# EAGLE design Headphone_Amp (EAGLE 9.5.0)
CNAME: Blueskylark Electronics; CREVISION: 1.0
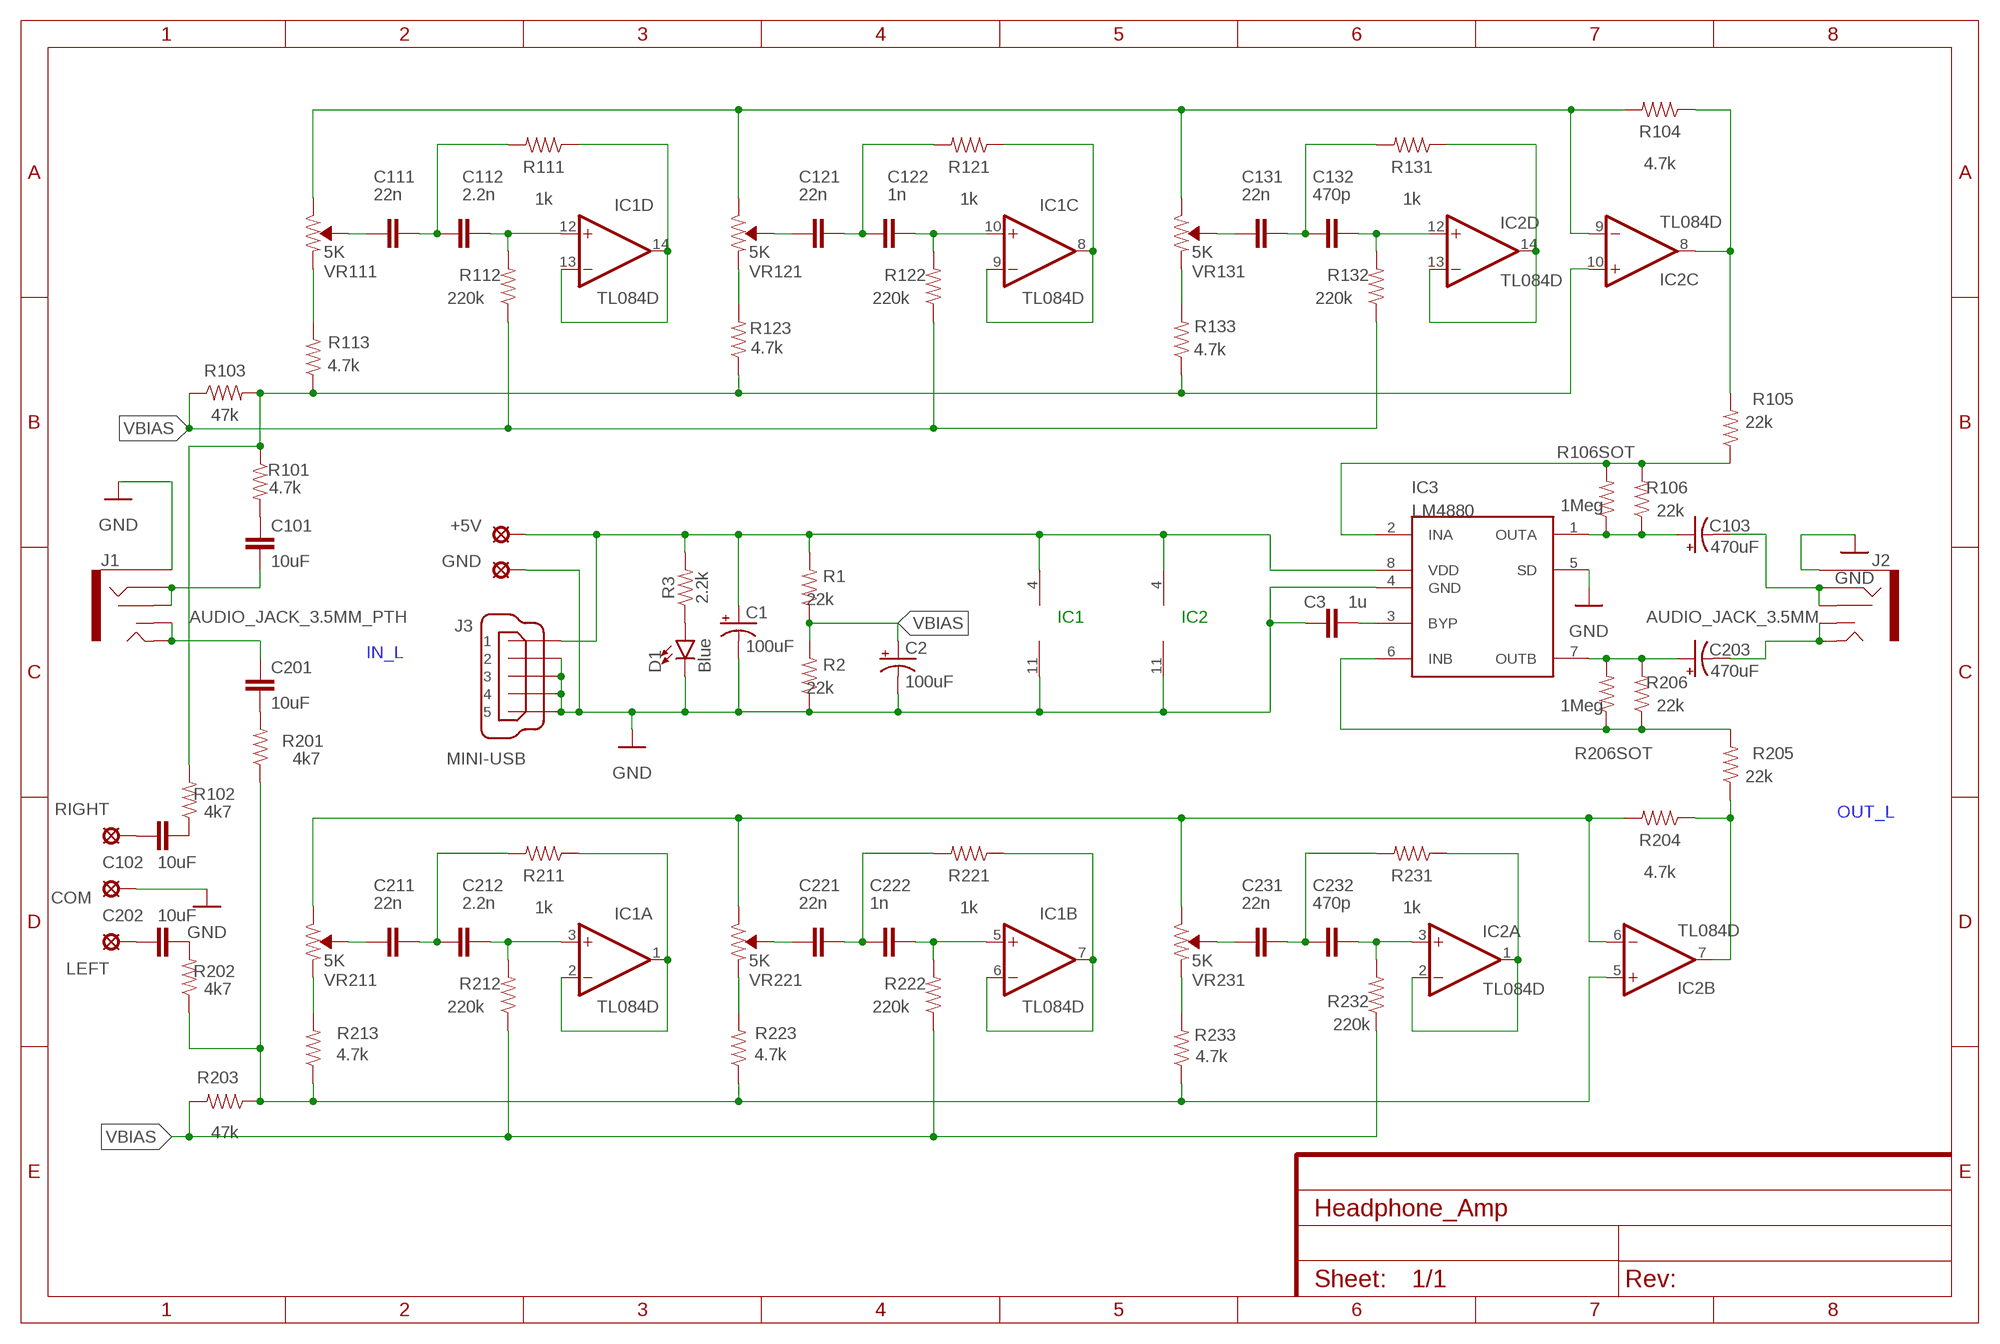
[diagram p0: schematic, sheet 1]

## Parts
+5V  SE14  [SE14]
C1  100uF  100UF-POLAR-EIA7343-16V-10%(TANT)  [EIA7343]
C2  100uF  100UF-POLAR-EIA7343-16V-10%(TANT)  [EIA7343]
C3  1u  0.1UF-0603-25V-5%  [0603]
C101  10uF  10UF-0805-10V-10%  [0805]
C102  10uF  10UF-0805-10V-10%  [0805]
C103  470uF  100UF-POLAR-EIA7343-16V-10%(TANT)  [EIA7343]
C111  22n  0.1UF-0603-25V-5%  [0603]
C112  2.2n  0.1UF-0603-25V-5%  [0603]
C121  22n  0.1UF-0603-25V-5%  [0603]
C122  1n  0.1UF-0603-25V-5%  [0603]
C131  22n  0.1UF-0603-25V-5%  [0603]
C132  470p  0.1UF-0603-25V-5%  [0603]
C201  10uF  10UF-0805-10V-10%  [0805]
C202  10uF  10UF-0805-10V-10%  [0805]
C203  470uF  100UF-POLAR-EIA7343-16V-10%(TANT)  [EIA7343]
C211  22n  0.1UF-0603-25V-5%  [0603]
C212  2.2n  0.1UF-0603-25V-5%  [0603]
C221  22n  0.1UF-0603-25V-5%  [0603]
C222  1n  0.1UF-0603-25V-5%  [0603]
C231  22n  0.1UF-0603-25V-5%  [0603]
C232  470p  0.1UF-0603-25V-5%  [0603]
COM  SE14  [SE14]
D1  Blue  LED3MM  [LED_3MM]
GND  SE14  [SE14]
IC1  TL084D  [SO14]
IC2  TL084D  [SO14]
IC3  LM4880  [SO08]
J1  AUDIO_JACK_3.5MM_PTH  [AUDIO-JACK]
J2  AUDIO_JACK_3.5MM  AUDIO_JACK_3.5MM_PTH  [AUDIO-JACK]
J3  MINI-USB  MINI-USB-UX60A-MB-5ST  [UX60A-MB-5ST]
LEFT  SE14  [SE14]
R1  22k  RESISTOR0603  [0603]
R2  22k  RESISTOR0603  [0603]
R3  2.2k  2.2KOHM-0603-1/10W-1%  [0603]
R101  4.7k  RESISTOR0603  [0603]
R102  4k7  RESISTOR0603  [0603]
R103  47k  RESISTOR0603  [0603]
R104  4.7k  RESISTOR0603  [0603]
R105  22k  RESISTOR0603  [0603]
R106  22k  RESISTOR0603  [0603]
R106SOT  1Meg  RESISTORAXIAL-0.3  [AXIAL-0.3]
R111  1k  RESISTOR0603  [0603]
R112  220k  RESISTOR0603  [0603]
R113  4.7k  4.7KOHM-0603-1/10W-1%  [0603]
R121  1k  RESISTOR0603  [0603]
R122  220k  RESISTOR0603  [0603]
R123  4.7k  4.7KOHM-0603-1/10W-1%  [0603]
R131  1k  RESISTOR0603  [0603]
R132  220k  RESISTOR0603  [0603]
R133  4.7k  4.7KOHM-0603-1/10W-1%  [0603]
R201  4k7  RESISTOR0603  [0603]
R202  4k7  RESISTOR0603  [0603]
R203  47k  RESISTOR0603  [0603]
R204  4.7k  RESISTOR0603  [0603]
R205  22k  RESISTOR0603  [0603]
R206  22k  RESISTOR0603  [0603]
R206SOT  1Meg  RESISTORAXIAL-0.3  [AXIAL-0.3]
R211  1k  RESISTOR0603  [0603]
R212  220k  RESISTOR0603  [0603]
R213  4.7k  4.7KOHM-0603-1/10W-1%  [0603]
R221  1k  RESISTOR0603  [0603]
R222  220k  RESISTOR0603  [0603]
R223  4.7k  4.7KOHM-0603-1/10W-1%  [0603]
R231  1k  RESISTOR0603  [0603]
R232  220k  RESISTOR0603  [0603]
R233  4.7k  4.7KOHM-0603-1/10W-1%  [0603]
RIGHT  SE14  [SE14]
VR111  5K  TRIMPOTTRIMPOT-PTH-3362P  [TRIMPOT-PTH-3362P]
VR121  5K  TRIMPOTTRIMPOT-PTH-3362P  [TRIMPOT-PTH-3362P]
VR131  5K  TRIMPOTTRIMPOT-PTH-3362P  [TRIMPOT-PTH-3362P]
VR211  5K  TRIMPOTTRIMPOT-PTH-3362P  [TRIMPOT-PTH-3362P]
VR221  5K  TRIMPOTTRIMPOT-PTH-3362P  [TRIMPOT-PTH-3362P]
VR231  5K  TRIMPOTTRIMPOT-PTH-3362P  [TRIMPOT-PTH-3362P]

## Nets
GND: C1.C(-) C2.C(-) C3.1 COM.MP D1.K(C) GND.MP IC1.11(P:V-) IC2.11(P:V-) IC3.4(GND) IC3.5(SD) J1.SLEEVE J2.SLEEVE J3.2 J3.3 J3.4 J3.5 R2.1
HDPHNE: C103.C(-) J2.RING J2.RSH
IN_L: C201.1 J1.TIP J1.TSH
N$1: C101.2 J1.RING J1.RSH
N$2: D1.A R3.1
N$3: C3.2 IC3.3(BYP)
N$4: C111.2 C112.1 R111.2
N$5: C112.2 IC1.12(D:+IN) R112.2
N$6: IC1.1(A:OUT) IC1.2(A:-IN) R211.1
N$7: C111.1 VR111.2(WIPER)
N$8: C203.C(-) J2.TIP J2.TSH
N$9: C121.2 C122.1 R121.2
N$10: C122.2 IC1.10(C:+IN) R122.2
N$11: C201.2 R201.2
N$12: R113.2 VR111.1(CCW)
N$13: C131.2 C132.1 R131.2
N$14: C132.2 IC2.12(D:+IN) R132.2
N$15: C121.1 VR121.2(WIPER)
N$16: IC3.2(INA) R105.1 R106.2 R106SOT.P$2
N$17: C103.A(+) IC3.1(OUTA) R106.1 R106SOT.P$1
N$18: IC3.6(INB) R205.2 R206.1 R206SOT.P$1
N$19: C203.A(+) IC3.7(OUTB) R206.2 R206SOT.P$2
N$20: R123.2 VR121.1(CCW)
N$21: C211.2 C212.1 R211.2
N$22: C212.2 IC1.3(A:+IN) R212.2
N$23: R213.2 VR211.1(CCW)
N$24: IC1.6(B:-IN) IC1.7(B:OUT) R221.1
N$25: IC2.1(A:OUT) IC2.2(A:-IN) R231.1
N$26: IC2.9(C:-IN) R104.2 VR111.3(CW) VR121.3(CW) VR131.3(CW)
N$27: C221.2 C222.1 R221.2
N$28: C222.2 IC1.5(B:+IN) R222.2
N$29: C211.1 VR211.2(WIPER)
N$30: IC2.6(B:-IN) R204.2 VR211.3(CW) VR221.3(CW) VR231.3(CW)
N$31: C231.2 C232.1 R231.2
N$32: C232.2 IC2.3(A:+IN) R232.2
N$33: R223.2 VR221.1(CCW)
N$34: IC1.8(C:OUT) IC1.9(C:-IN) R121.1
N$35: R133.2 VR131.1(CCW)
N$36: IC2.10(C:+IN) R101.1 R102.2 R103.2 R113.1 R123.1 R133.1
N$37: +5V.MP C1.A(+) IC1.4(P:V+) IC2.4(P:V+) IC3.8(VDD) J3.1 R1.2 R3.2
N$38: C101.1 R101.2
N$42: IC1.13(D:-IN) IC1.14(D:OUT) R111.1
N$43: C131.1 VR131.2(WIPER)
N$44: IC2.13(D:-IN) IC2.14(D:OUT) R131.1
N$46: C221.1 VR221.2(WIPER)
N$47: C231.1 VR231.2(WIPER)
N$48: R233.2 VR231.1(CCW)
N$52: C102.1 RIGHT.MP
N$53: C202.1 LEFT.MP
N$54: C202.2 R202.2
N$55: C102.2 R102.1
N$56: IC2.5(B:+IN) R201.1 R202.1 R203.1 R213.1 R223.1 R233.1
OUT-R: IC2.8(C:OUT) R104.1 R105.2
OUT_L: IC2.7(B:OUT) R204.1 R205.1
VBIAS: C2.A(+) R1.1 R2.2 R103.1 R112.1 R122.1 R132.1 R203.2 R212.1 R222.1 R232.1

## Notes on the sheet
- IC1 | IC2

## Library data of the parts
+5V = solpad:SE14: SOLDER PAD E1553, drill 1,4mm, distributor Buerklin, 07F820; SPICEMODEL: PwrPlus; SPICEPREFIX: X
C1 C2 = SparkFun-Capacitors:100UF-POLAR: 100µF polarized capacitors A capacitor is a passive two-terminal electrical component used to store electrical energy temporarily in an electric field.; PROD_ID: CAP-08702; SPICEPREFIX: C
C3 C111 C112 C121 C122 C131 C132 C211 C212 C221 C222 C231 C232 = SparkFun-Capacitors:0.1UF: 0.1µF ceramic capacitors A capacitor is a passive two-terminal electrical component used to store electrical energy temporarily in an electric field.; PROD_ID: CAP-08604; SPICEPREFIX: C; VALUE: 0.1uF
C101 C102 C201 C202 = SparkFun-Capacitors:10UF: 10.0µF ceramic capacitors A capacitor is a passive two-terminal electrical component used to store electrical energy temporarily in an electric field.; PROD_ID: CAP-11330; SPICEPREFIX: C
C103 C203 = SparkFun-Capacitors:100UF-POLAR: 100µF polarized capacitors A capacitor is a passive two-terminal electrical component used to store electrical energy temporarily in an electric field.; PROD_ID: CAP-08702; SPICEPREFIX: C; VALUE: 100uF
COM GND = solpad:SE14: SOLDER PAD E1553, drill 1,4mm, distributor Buerklin, 07F820; SPICEMODEL: PwrMinus; SPICEPREFIX: X
D1 = SparkFun-LED:LED: LED (Generic) Standard schematic elements and footprints for 5mm, 3mm, 1206, and 0603 sized LEDs. Generic LEDs with no color specified.; PROD_ID: DIO-08794; SPICEMODEL: DMOD; SPICEPREFIX: D
IC1 IC2 = linear:TL084: OP AMP; SPICEMODEL: TL084x4; SPICEPREFIX: X
IC3 = LM4880:LM4880; AVAILABILITY: Unavailable; MF: Texas Instruments; MP: LM4880; PACKAGE: None; PRICE: None; SPICEMODEL: Fake_LM4880; SPICEPREFIX: X
J1 = SparkFun-Connectors:AUDIO_JACK_3.5MM: Audio Jack 3.5mm variants of PTH and SMT stereo audio jack with bypass switches. SparkFun Products: SparkFun SparkPunk Sound Kit <[https://www.sparkfun.com/products/11177]> - PTH MP3 Trigger <https://www.sparkfun.com/products/13720> -3.5mm SMD SparkFun PicoBoard <https://www.sparkfun.com/products/11888>- 2.5mm SMD; PROD_ID: CONN-08774; SF_ID: PRT-08032; SPICEMODEL: StereoIn; SPICEPREFIX: X
J2 = SparkFun-Connectors:AUDIO_JACK_3.5MM: Audio Jack 3.5mm variants of PTH and SMT stereo audio jack with bypass switches. SparkFun Products: SparkFun SparkPunk Sound Kit <[https://www.sparkfun.com/products/11177]> - PTH MP3 Trigger <https://www.sparkfun.com/products/13720> -3.5mm SMD SparkFun PicoBoard <https://www.sparkfun.com/products/11888>- 2.5mm SMD; PROD_ID: CONN-08774; SF_ID: PRT-08032; SPICEMODEL: StereoOut; SPICEPREFIX: X
J3 = con-hirose:MINI-USB-: MINI USB Connector Source: http://www.hirose.co.jp/cataloge_hp/e24000019.pdf; OC_FARNELL: unknown; OC_NEWARK: unknown; SPICEMODEL: USBSupply; SPICEPREFIX: X
LEFT RIGHT = solpad:SE14: SOLDER PAD E1553, drill 1,4mm, distributor Buerklin, 07F820; SPICEMODEL: AudioIn; SPICEPREFIX: X
R1 R2 R101-R106 R106SOT R111 R112 R121 R122 R131 R132 R201-R206 R206SOT R211 R212 R221 R222 R231 R232 = SparkFun-Resistors:RESISTOR: Generic Resistor Package; SPICEPREFIX: R
R3 = SparkFun-Resistors:2.2KOHM: 2.2kΩ resistor A resistor is a passive two-terminal electrical component that implements electrical resistance as a circuit element. Resistors act to reduce current flow, and, at the same time, act to lower voltage levels within circuits. - Wikipedia; PROD_ID: RES-08272; SPICEPREFIX: R
R113 R123 R133 R213 R223 R233 = SparkFun-Resistors:4.7KOHM: 4.7kΩ resistor A resistor is a passive two-terminal electrical component that implements electrical resistance as a circuit element. Resistors act to reduce current flow, and, at the same time, act to lower voltage levels within circuits. - Wikipedia; PROD_ID: RES-07857; SPICEPREFIX: R
VR111 VR211 = SparkFun-Resistors:TRIMPOT: Trimming Potentiometer (Trimpot) Philip wos 'ere Three-terminal potentiometers, with an adjustable wiper and two adjustable resistors. A pot can be used to create a configurable voltage divider, or as a variable resistor. "Trimpots" are a subset of potentiometers, usually intended for "set-and-forget" applications. They're often more delicate than standard potentiometers - rated for fewer turns. Variants PTH-KNOB - PTH Trimpot w/ finger-adjustable knob Trimpot 10K with Knob <https://www.sparkfun.com/products/9806> (COM-09806) Datasheet <http://www.sparkfun.com/datasheets/Components/General/TSR-3386.pdf> SMD-3MM-CLOSED-FRAME - SMD 3mm Square Closed-Frame Trimpot Used on e.g. EasyDriver - Stepper Motor Driver <https://www.sparkfun.com/products/12779> Datasheet <http://www.bitechnologies.com/pdfs/22.pdf> (22AR10KTR) SMD-5MM - SMD 5mm Square Closed-Frame Trimpot Used on e.g. IOIO-OTG - V2.2 <https://www.sparkfun.com/products/13613> Datasheet <http://www.vishay.com/docs/51008/ts53.pdf> (TS53YL502MR10) SMD-3MM-1/10W-25% - 3mm Square Open-Frame Trimpot Used on e.g. SparkFun Shapeoko <https://www.sparkfun.com/products/13899> Datasheet <http://www.bourns.com/docs/Product-Datasheets/TC33.pdf> (TC33X-2-103E); SPICEMODEL: POT_VR111; SPICEPREFIX: X
VR121 VR221 = SparkFun-Resistors:TRIMPOT: Trimming Potentiometer (Trimpot) Philip wos 'ere Three-terminal potentiometers, with an adjustable wiper and two adjustable resistors. A pot can be used to create a configurable voltage divider, or as a variable resistor. "Trimpots" are a subset of potentiometers, usually intended for "set-and-forget" applications. They're often more delicate than standard potentiometers - rated for fewer turns. Variants PTH-KNOB - PTH Trimpot w/ finger-adjustable knob Trimpot 10K with Knob <https://www.sparkfun.com/products/9806> (COM-09806) Datasheet <http://www.sparkfun.com/datasheets/Components/General/TSR-3386.pdf> SMD-3MM-CLOSED-FRAME - SMD 3mm Square Closed-Frame Trimpot Used on e.g. EasyDriver - Stepper Motor Driver <https://www.sparkfun.com/products/12779> Datasheet <http://www.bitechnologies.com/pdfs/22.pdf> (22AR10KTR) SMD-5MM - SMD 5mm Square Closed-Frame Trimpot Used on e.g. IOIO-OTG - V2.2 <https://www.sparkfun.com/products/13613> Datasheet <http://www.vishay.com/docs/51008/ts53.pdf> (TS53YL502MR10) SMD-3MM-1/10W-25% - 3mm Square Open-Frame Trimpot Used on e.g. SparkFun Shapeoko <https://www.sparkfun.com/products/13899> Datasheet <http://www.bourns.com/docs/Product-Datasheets/TC33.pdf> (TC33X-2-103E); SPICEMODEL: POT_VR121; SPICEPREFIX: X
VR131 VR231 = SparkFun-Resistors:TRIMPOT: Trimming Potentiometer (Trimpot) Philip wos 'ere Three-terminal potentiometers, with an adjustable wiper and two adjustable resistors. A pot can be used to create a configurable voltage divider, or as a variable resistor. "Trimpots" are a subset of potentiometers, usually intended for "set-and-forget" applications. They're often more delicate than standard potentiometers - rated for fewer turns. Variants PTH-KNOB - PTH Trimpot w/ finger-adjustable knob Trimpot 10K with Knob <https://www.sparkfun.com/products/9806> (COM-09806) Datasheet <http://www.sparkfun.com/datasheets/Components/General/TSR-3386.pdf> SMD-3MM-CLOSED-FRAME - SMD 3mm Square Closed-Frame Trimpot Used on e.g. EasyDriver - Stepper Motor Driver <https://www.sparkfun.com/products/12779> Datasheet <http://www.bitechnologies.com/pdfs/22.pdf> (22AR10KTR) SMD-5MM - SMD 5mm Square Closed-Frame Trimpot Used on e.g. IOIO-OTG - V2.2 <https://www.sparkfun.com/products/13613> Datasheet <http://www.vishay.com/docs/51008/ts53.pdf> (TS53YL502MR10) SMD-3MM-1/10W-25% - 3mm Square Open-Frame Trimpot Used on e.g. SparkFun Shapeoko <https://www.sparkfun.com/products/13899> Datasheet <http://www.bourns.com/docs/Product-Datasheets/TC33.pdf> (TC33X-2-103E); SPICEMODEL: POT_VR131; SPICEPREFIX: X

## Board
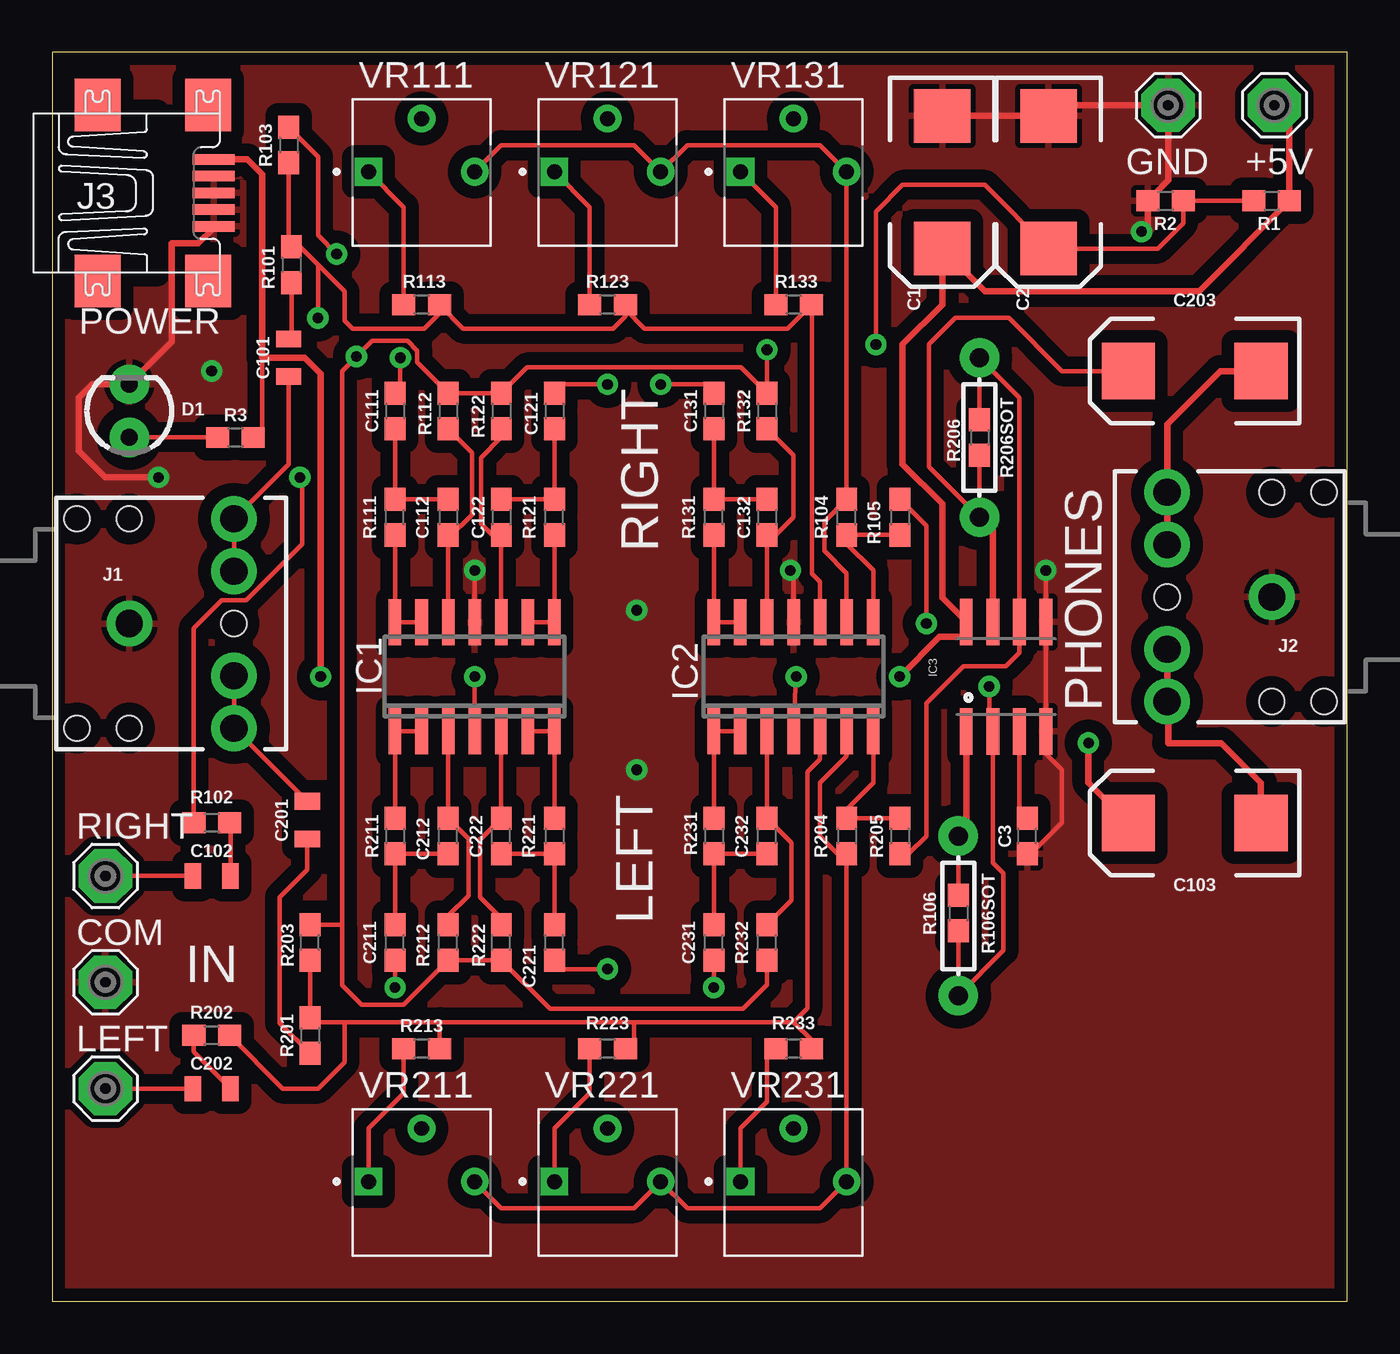
[diagram p1: board, top side]
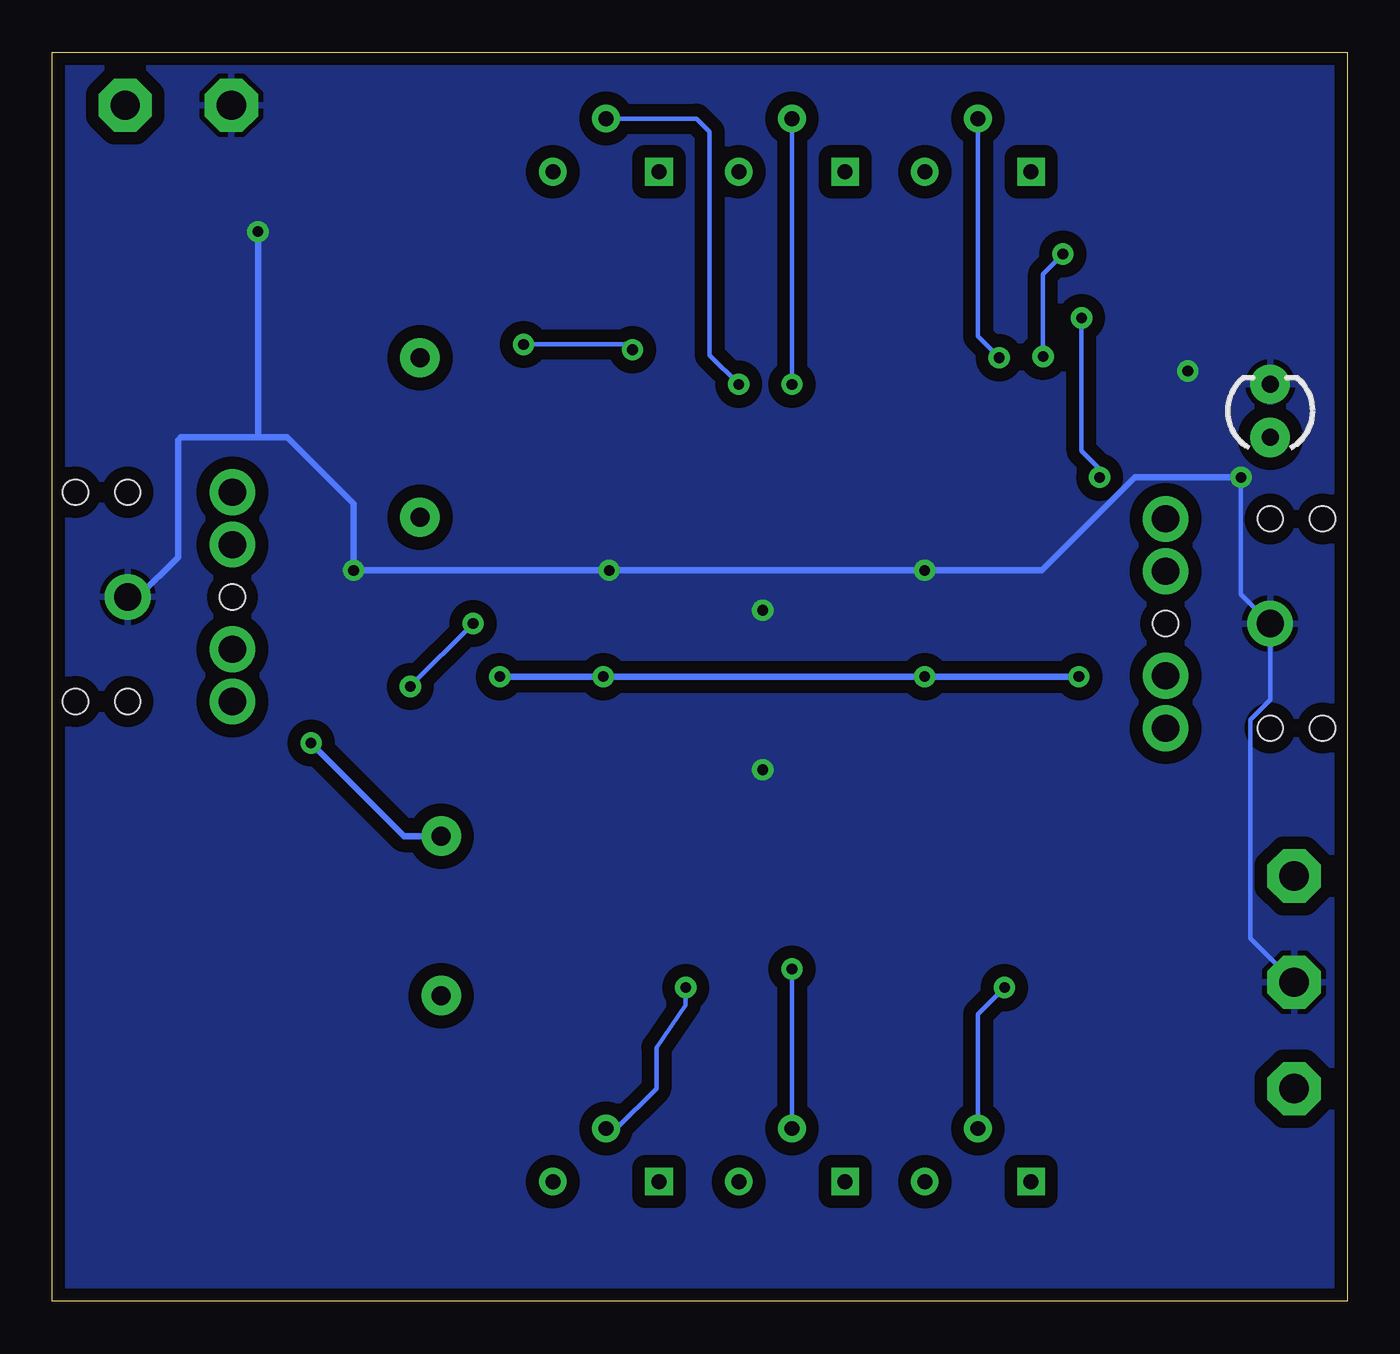
[diagram p2: board, bottom side, seen from below]

Size 61.9 x 59.68 mm. Coordinates in mm from the lower left corner, seen from the top.
Outline: 0,0 61.9,0 61.9,59.68 0,59.68 0,0
Copper layers (1*16): Top 0.035mm / dielectric 1.5mm / Bottom 0.035mm
Design rules "SparkFun": minimum track width 8mil, minimum drill 20mil, track to track 8mil, track to pad 8mil, pad to pad 8mil, via to via 8mil, smd to smd 8mil, copper to edge 10mil, drill to drill 8mil, minimum pad ring 12mil, minimum via ring 10mil, stop-mask expansion 4mil, vias tented up to drill 25mil, thermal gap 10mil

### Footprints (pad centres in the part's own frame; a part is rotated, then mirrored left to right if it is on the bottom)
SE14 = drill 1.397 pad 2.54 octagon: MP 0,0
EIA7343 = smd 2.55 x 2.7: A 3.17,0; C -3.17,0
0603 = smd 1.1 x 1: 1 -0.85,0; 2 0.85,0
0805 = smd 0.8 x 1.2: 1 -0.9,0; 2 0.9,0
LED_3MM = drill 0.813 pad 1.88: A -1.27,0; K 1.27,0
SO14 = smd 0.6 x 2.2: 1 -3.81,-2.6; 2 -2.54,-2.6; 3 -1.27,-2.6; 4 0,-2.6; 5 1.27,-2.6; 6 2.54,-2.6; 7 3.81,-2.6; 8 3.81,2.6; 9 2.54,2.6; 10 1.27,2.6; 11 0,2.6; 12 -1.27,2.6; 13 -2.54,2.6; 14 -3.81,2.6
SO08 = smd 0.61 x 2.21: 1 -1.905,-2.616; 2 -0.635,-2.616; 3 0.635,-2.616; 4 1.905,-2.616; 5 1.905,2.616; 6 0.635,2.616; 7 -0.635,2.616; 8 -1.905,2.616
AUDIO-JACK = drill 1.3 pad 2.184: RING 5,5; RSH 5,2.5; SLEEVE 0,0; TIP 5,-5; TSH 5,-2.5 | hole 1.2: 0,5; -2.5,5; -2.5,-5; 0,-5; 5,0
UX60A-MB-5ST = smd 2 x 0.5: 1 2.25,1.6; 2 2.25,0.8; 3 2.25,0; 4 2.25,-0.8; 5 2.25,-1.6 | smd 2.2 x 2.5: M1 -3.3,-4.2; M2 -3.3,4.2; M3 2,4.2; M4 2,-4.2
AXIAL-0.3 = drill 0.9 pad 1.88: P$1 -3.81,0; P$2 3.81,0
TRIMPOT-PTH-3362P = drill 0.714 square: 1 -2.54,0 | drill 0.714: 2 0,2.54; 3 2.54,0

### Placement (x,y rotation side)
+5V  58.42,57.15 0 top
C1  42.55,53.47 270 top
C2  47.62,53.47 270 top
C3  46.61,22.23 90 top
C101  11.3,45.09 270 top
C102  7.62,20.32 0 top
C103  54.61,22.86 180 top
C111  16.38,42.55 270 top
C112  18.92,37.47 270 top
C121  24,42.55 270 top
C122  21.46,37.47 270 top
C131  31.62,42.55 270 top
C132  34.16,37.47 270 top
C201  12.19,22.99 270 top
C202  7.62,10.16 0 top
C203  54.61,44.45 180 top
C211  16.38,17.14 90 top
C212  18.92,22.23 90 top
C221  24,17.14 90 top
C222  21.46,22.23 90 top
C231  31.62,17.14 90 top
C232  34.16,22.23 90 top
COM  2.54,15.24 0 top
D1  3.68,42.55 90 top
GND  53.34,57.15 0 top
IC1  20.19,29.84 0 top
IC2  35.43,29.84 0 top
IC3  45.59,29.84 0 top
J1  3.68,32.38 0 top
J2  58.29,33.66 180 top
J3  5.46,52.96 0 top
LEFT  2.54,10.16 0 top
R1  58.29,52.58 0 top
R2  53.21,52.58 0 top
R3  8.76,41.27 0 top
R101  11.43,49.53 270 top
R102  7.62,22.86 180 top
R103  11.3,55.24 270 top
R104  37.97,37.47 90 top
R105  40.51,37.47 270 top
R106  43.31,18.54 270 top
R106SOT  43.31,18.41 270 top
R111  16.38,37.47 90 top
R112  18.92,42.55 270 top
R113  17.65,47.62 180 top
R121  24,37.47 90 top
R122  21.46,42.55 270 top
R123  26.54,47.62 180 top
R131  31.62,37.47 90 top
R132  34.16,42.55 270 top
R133  35.43,47.62 180 top
R201  12.32,12.7 270 top
R202  7.62,12.7 180 top
R203  12.32,17.14 90 top
R204  37.97,22.23 270 top
R205  40.51,22.23 270 top
R206  44.32,41.27 270 top
R206SOT  44.32,41.27 270 top
R211  16.38,22.23 270 top
R212  18.92,17.14 90 top
R213  17.65,12.06 180 top
R221  24,22.23 270 top
R222  21.46,17.14 90 top
R223  26.54,12.06 180 top
R231  31.62,22.23 270 top
R232  34.16,17.14 90 top
R233  35.43,12.06 180 top
RIGHT  2.54,20.32 0 top
VR111  17.65,53.98 0 top
VR121  26.54,53.98 0 top
VR131  35.43,53.98 0 top
VR211  17.65,5.71 0 top
VR221  26.54,5.71 0 top
VR231  35.43,5.71 0 top

### Tracks (layer width: path | path; a pad name or v marks a point on that pad's centre or on a via)
GND  (via drill 0.51)
  Top 0.203: IC1.11 v20.19,34.92 | v35.28,34.92 35.43,34.77 IC2.11 | v47.5,34.92 IC3.5 IC3.4 47.5,26.16 48.26,25.4 48.26,22.86 46.77,21.38 C3.1 | 7.71,51.27 J3.5 | C2.C 48.14,57.15
  Top 0.305: C2.C C1.C | v5.08,39.37 2.54,39.37 1.27,40.64 1.27,43.18 1.91,43.81 D1.K 5.71,45.85 5.71,50.55 6.99,50.55 7.71,51.27 | 48.14,57.15 GND.MP 53.34,53.55 R2.1 52.36,51.4 v52.07,51.11
  Bottom 0.203: 55.75,41.27 55.88,41.15 | 57.78,33.66 J2.SLEEVE | v5.08,39.37 5.08,33.78 J1.SLEEVE 3.68,28.74 4.64,27.78 4.64,17.34 COM.MP
  Bottom 0.305: 52.07,41.27 50.67,41.27 47.5,38.1 v47.5,34.92 v35.28,34.92 v20.19,34.92 14.61,34.92 10.16,39.37 v5.08,39.37 | 52.07,41.27 55.75,41.27 | 55.88,41.15 55.88,35.56 57.78,33.66 | v52.07,51.11 52.07,41.27
  other vias: 27.94,33.02 27.94,25.4 7.62,44.45
  pour Top (isolate 0.61): 0,0 0,59.69 61.98,59.69 61.98,0
  pour Bottom (isolate 0.61): 0,0 0,59.69 61.85,59.69 61.85,0
HDPHNE
  Top 0.203: J2.RING 53.34,28.61
  Top 0.305: J2.RSH J2.RING | 53.34,28.61 53.34,26.67 55.88,26.67 57.78,24.77 C103.C
IN_L
  Top 0.203: J1.TSH J1.TIP C201.1
N$1
  Top 0.203: J1.RSH J1.RING 11.3,40.01 C101.2
N$2
  Top 0.203: R3.1 D1.A
N$3
  Top 0.203: IC3.3 46.23,23.46 C3.2
N$4
  Top 0.203: C112.1 R111.2 C111.2
N$5
  Top 0.203: IC1.12 18.92,36.45 | 18.92,36.45 C112.2 | R112.2 20.07,40.55 20.07,37.59 18.92,36.45
N$6
  Top 0.203: IC1.2 IC1.1 R211.1
N$7  (via drill 0.51)
  Top 0.203: v16.64,45.09 16.64,43.65 C111.1
  Bottom 0.203: VR111.2 17.65,46.1 v16.64,45.09
N$8
  Top 0.305: J2.TSH J2.TIP 53.29,41.91 55.83,44.45 C203.C
N$9
  Top 0.203: C121.2 R121.2 C122.1
N$10
  Top 0.203: IC1.10 21.46,36.2 | 21.46,36.2 C122.2 | R122.2 21.46,41.27 20.5,40.31 20.5,37.16 21.46,36.2
N$11
  Top 0.203: C201.2 12.19,20.62 10.88,19.31 10.88,13.29 R201.2
N$12
  Top 0.203: VR111.1 16.8,52.28 R113.2
N$13
  Top 0.203: C131.2 31.62,38.73 | 31.62,38.73 R131.2 | C132.1 32.04,38.31 31.62,38.73
N$14
  Top 0.203: IC2.12 C132.2 34.58,36.62 35.43,37.47 35.43,40.42 R132.2
N$15  (via drill 0.51)
  Top 0.203: C121.1 24.42,43.81 v26.54,43.81
  Bottom 0.203: VR121.2 v26.54,43.81
N$16  (via drill 0.51)
  Top 0.203: v44.79,29.38 44.79,27.4 IC3.2 44.96,20.95 45.47,20.45 45.47,16.76 R106SOT.P$2 R106.2 | R105.1 41.78,37.05 v41.78,32.38
  Bottom 0.203: v41.78,32.38 v44.79,29.38
N$17  (via drill 0.51)
  Top 0.203: R106.1 R106SOT.P$1
  Top 0.305: IC3.1 43.69,22.23 R106SOT.P$1 | C103.A 49.53,24.77 v49.53,26.67
  Bottom 0.305: v49.53,26.67 45.09,22.23 R106SOT.P$1
N$18
  Top 0.203: R205.2 40.93,21.38 41.78,22.23 41.78,28.57 43.56,30.35 45.59,30.35 46.23,30.99 IC3.6 46.23,43.18 44.96,44.45 44.32,44.45 | R206SOT.P$1 44.32,44.45 | 44.32,44.45 R206.1
N$19
  Top 0.203: 44.96,36.83 R206SOT.P$2 | R206SOT.P$2 R206.2 | R206SOT.P$2 41.91,39.88 41.91,45.72 43.18,46.99 45.72,46.99 48.26,44.45 C203.A
  Top 0.305: IC3.7 44.96,36.83
N$20
  Top 0.203: VR121.1 25.69,52.28 R123.2
N$21
  Top 0.203: C211.2 R211.2 C212.1
N$22
  Top 0.203: IC1.3 18.92,24.13 C212.2 19.89,22.11 19.89,19.38 18.92,18.41 R212.2
N$23
  Top 0.203: VR211.1 15.11,8.26 16.8,9.95 R213.2
N$24
  Top 0.203: R221.1 IC1.7 IC1.6
N$25
  Top 0.203: R231.1 IC2.1 IC2.2
N$26
  Top 0.203: IC2.9 37.97,33.66 37.97,34.8 36.91,35.86 36.91,37.26 R104.2 VR131.3 36.7,55.24 30.35,55.24 VR121.3 27.81,55.24 21.46,55.24 VR111.3
N$27
  Top 0.203: C222.1 R221.2 C221.2
N$28
  Top 0.203: IC1.5 C222.2 20.49,22.1 20.45,22.1 20.45,19.3 21.34,18.41 21.46,18.41 R222.2
N$29  (via drill 0.51)
  Top 0.203: C211.1 v16.38,14.99
  Bottom 0.203: v16.38,14.99 17.65,13.72 VR211.2
N$30
  Top 0.203: VR211.3 21.46,4.45 27.81,4.45 VR221.3 30.35,4.45 36.7,4.45 VR231.3 R204.2 37.97,20.95 36.7,22.23 36.7,24.77 37.97,26.04 IC2.6
N$31
  Top 0.203: C232.1 R231.2 C231.2
N$32
  Top 0.203: IC2.3 C232.2 35.33,21.91 35.33,19.16 R232.2
N$33
  Top 0.203: VR221.1 24,8.26 25.69,9.95 R223.2
N$34
  Top 0.203: IC1.9 IC1.8 R121.1
N$35
  Top 0.203: VR131.1 34.58,52.28 R133.2
N$36  (via drill 0.51)
  Top 0.203: IC2.10 36.7,34.39 36.32,34.77 36.32,47.59 R133.1 35.14,46.48 28.32,46.48 27.39,47.41 R123.1 27.39,47.08 26.8,46.48 19.65,46.48 R113.1 18.5,47.2 17.78,46.48 14.35,46.48 13.97,46.86 13.97,48.26 12.7,49.53 | R103.2 11.3,50.51 R101.1 11.85,50.38 12.7,49.53 | R102.2 6.77,32.17 8.09,33.49 9.26,33.49 11.94,36.16 11.94,39.27 v11.84,39.37 | v12.7,46.99 12.7,49.53
  Bottom 0.203: v11.84,39.37 11.84,39.78 12.7,40.64 v12.7,46.99
N$37  (via drill 0.51)
  Top 0.203: R3.2 10.03,41.7 10.03,45.09 | 43.69,31.75 IC3.8 | IC2.4 v35.56,29.84 | IC1.4 v20.19,29.84
  Top 0.305: J3.1 9.32,54.56 10.03,53.85 10.03,45.09 12.06,45.09 12.83,44.32 v12.83,29.84 | +5V.MP 59.14,56.43 R1.2 54.83,48.26 44.58,48.26 C1.A 42.55,47.62 40.64,45.72 40.64,40.01 42.55,38.1 42.55,33.6 IC3.8 | v40.51,29.84 42.42,31.75 43.69,31.75
  Bottom 0.305: v12.83,29.84 v20.19,29.84 v35.56,29.84 v40.51,29.84
N$38
  Top 0.203: R101.2 11.43,46.11 C101.1
N$42
  Top 0.203: R111.1 IC1.14 IC1.13
N$43  (via drill 0.51)
  Top 0.203: C131.1 31.2,43.81 v29.08,43.81
  Bottom 0.203: VR131.2 31.11,56.52 30.48,55.88 30.48,45.21 v29.08,43.81
N$44
  Top 0.203: R131.1 IC2.14 IC2.13
N$46  (via drill 0.51)
  Top 0.203: C221.1 24.42,15.88 v26.54,15.88
  Bottom 0.203: v26.54,15.88 VR221.2
N$47  (via drill 0.51)
  Top 0.203: C231.1 v31.62,14.99
  Bottom 0.203: v31.62,14.99 31.62,14.15 33.02,12.12 33.02,10.16 34.92,8.26 VR231.2
N$48
  Top 0.203: VR231.1 32.89,8.26 34.16,9.53 34.16,12.06 R233.2
N$52
  Top 0.203: RIGHT.MP C102.1
N$53
  Top 0.203: LEFT.MP C202.1
N$54
  Top 0.203: C202.2 6.77,11.91 R202.2
N$55
  Top 0.203: C102.2 8.52,22.81 R102.1
N$56
  Top 0.203: 13.97,13.34 18.54,13.34 | 18.54,13.34 27.81,13.34 | 27.81,13.34 35.43,13.34 | 35.43,13.34 36.28,12.48 R233.1 | R223.1 27.81,12.48 27.81,13.34 | 35.43,13.34 36.09,13.99 36.09,25.29 36.7,25.9 IC2.5 | R202.1 11.01,10.16 12.7,10.16 13.97,11.43 13.97,13.34 | R213.1 18.5,13.3 18.54,13.34 | 13.97,13.34 12.53,13.34 R201.1 R203.1
OUT-R
  Top 0.203: R105.2 R104.1 37.97,36.2 39.24,34.92 IC2.8
OUT_L
  Top 0.203: R205.1 R204.1 37.97,23.5 39.24,24.77 IC2.7
VBIAS  (via drill 0.51)
  Top 0.203: 13.84,17.91 13.84,44.45 v14.54,45.15 15.29,45.9 16.97,45.9 17.45,45.42 17.45,44.87 R112.1 R122.1 22.7,44.63 32.93,44.63 R132.1 v34.16,45.47 | 13.84,17.91 13.84,15.11 14.78,14.17 16.8,14.17 R212.1 R222.1 23.79,13.97 33.02,13.97 34.16,15.11 R232.1 | R1.1 R2.2 54.06,51.52 52.84,50.3 C2.A 44.58,53.34 40.64,53.34 39.37,52.07 v39.37,45.72 | R203.2 13.76,18 13.84,17.91 | v13.59,50.04 12.7,50.93 12.7,54.7 R103.1
  Bottom 0.203: v39.37,45.72 34.42,45.72 v34.16,45.47 | v14.54,45.15 14.54,49.09 v13.59,50.04

### Text on the board
tNames: POWER | RIGHT | PHONES | LEFT | IN